# Altium schematic sheet downmixersA.SchDoc
size A4
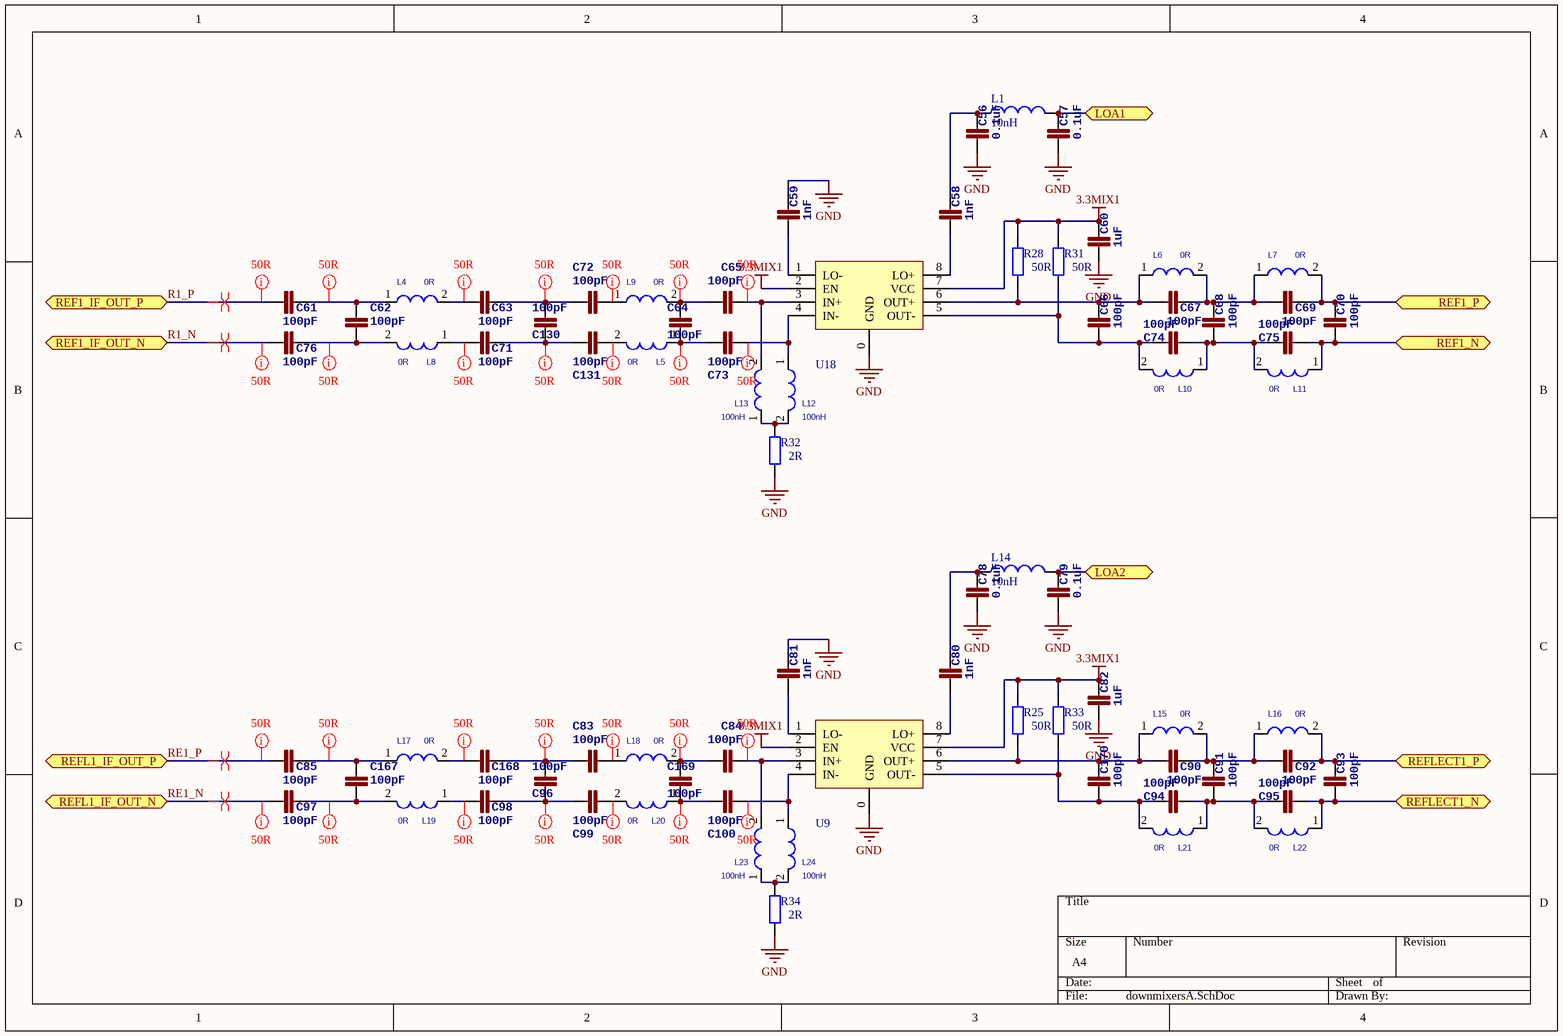
[diagram p0: downmixersA.SchDoc]

## Parts
C56  0.1uF  [0402]
C57  0.1uF  [0402]
C58  1nF  [0402]
C59  1nF  [0402]
C60  1uF  [0402]
C61  100pF  [0402]
C62  100pF  [0402]
C63  100pF  [0402]
C64  100pF  [0402]
C65  100pF  [0402]
C66  100pF  [0402]
C67  100pF  [0402]
C68  100pF  [0402]
C69  100pF  [0402]
C70  100pF  [0402]
C71  100pF  [0402]
C72  100pF  [0402]
C73  100pF  [0402]
C74  100pF  [0402]
C75  100pF  [0402]
C76  100pF  [0402]
C78  0.1uF  [0402]
C79  0.1uF  [0402]
C80  1nF  [0402]
C81  1nF  [0402]
C82  1uF  [0402]
C83  100pF  [0402]
C84  100pF  [0402]
C85  100pF  [0402]
C90  100pF  [0402]
C91  100pF  [0402]
C92  100pF  [0402]
C93  100pF  [0402]
C94  100pF  [0402]
C95  100pF  [0402]
C96  100pF  [0402]
C97  100pF  [0402]
C98  100pF  [0402]
C99  100pF  [0402]
C100  100pF  [0402]
C130  100pF  [0402]
C131  100pF  [0402]
C167  100pF  [0402]
C168  100pF  [0402]
C169  100pF  [0402]
C170  100pF  [0402]
L1  value 10nH  [0402]  (hidden comment: Inductor)
L4  0R  [0805]
L5  0R  [0805]
L6  0R  [0805]
L7  0R  [0805]
L8  0R  [0805]
L9  0R  [0805]
L10  0R  [0805]
L11  0R  [0805]
L12  100nH  [0402]
L13  100nH  [0402]
L14  value 10nH  [0402]  (hidden comment: Inductor)
L15  0R  [0805]
L16  0R  [0805]
L17  0R  [0805]
L18  0R  [0805]
L19  0R  [0805]
L20  0R  [0805]
L21  0R  [0805]
L22  0R  [0805]
L23  100nH  [0402]
L24  100nH  [0402]
R25  50R  [0402]
R28  50R  [0402]
R31  50R  [0402]
R32  2R  [0402]
R33  50R  [0402]
R34  2R  [0402]
U9  LT5560  [LT5560]  (value not drawn)
U18  LT5560  [LT5560]  (value not drawn)

## Ports
LOA1, LOA2, REF1_IF_OUT_N, REF1_IF_OUT_P, REF1_N, REF1_P, REFL1_IF_OUT_N, REFL1_IF_OUT_P, REFLECT1_N, REFLECT1_P

## Nets
3.3MIX1: C60.2 C82.2 R25.2 R28.2 R31.2 R33.2 U9.2(EN) U9.7(VCC) U18.2(EN) U18.7(VCC)
GND: C56.1 C57.1 C59.2 C60.1 C78.1 C79.1 C81.2 C82.1 R32.1 R34.1 U9.0(GND) U18.0(GND)
LOA1: C57.2 L1.2 ; port LOA1
LOA2: C79.2 L14.2 ; port LOA2
R1_N: C76.1 ; port REF1_IF_OUT_N
R1_P: C61.1 ; port REF1_IF_OUT_P
RE1_N: C97.1 ; port REFL1_IF_OUT_N
RE1_P: C85.1 ; port REFL1_IF_OUT_P
REF1_N: C70.1 C75.1 L11.1 ; port REF1_N
REF1_P: C69.2 C70.2 L7.2 ; port REF1_P
REFLECT1_N: C93.1 C95.1 L22.1 ; port REFLECT1_N
REFLECT1_P: C92.2 C93.2 L16.2 ; port REFLECT1_P
NetC56_2: C56.2 C58.2 L1.1
NetC58_1: C58.1 U18.8(LO+)
NetC59_1: C59.1 U18.1(LO-)
NetC61_2: C61.2 C62.2 L4.1
NetC62_1: C62.1 C76.2 L8.2
NetC63_1: C63.1 L4.2
NetC63_2: C63.2 C72.1 C130.1
NetC64_1: C64.1 C73.2 L5.1
NetC64_2: C64.2 C65.1 L9.2
NetC65_2: C65.2 L13.2 U18.3(IN+)
NetC66_1: C66.1 C74.2 L10.2 R31.1 U18.5(OUT-)
NetC66_2: C66.2 C67.1 L6.1 R28.1 U18.6(OUT+)
NetC67_2: C67.2 C68.2 C69.1 L6.2 L7.1
NetC68_1: C68.1 C74.1 C75.2 L10.1 L11.2
NetC71_1: C71.1 L8.1
NetC71_2: C71.2 C130.2 C131.2
NetC72_2: C72.2 L9.1
NetC73_1: C73.1 L12.1 U18.4(IN-)
NetC78_2: C78.2 C80.2 L14.1
NetC80_1: C80.1 U9.8(LO+)
NetC81_1: C81.1 U9.1(LO-)
NetC83_1: C83.1 C96.1 C168.2
NetC83_2: C83.2 L18.1
NetC84_1: C84.1 C169.2 L18.2
NetC84_2: C84.2 L23.2 U9.3(IN+)
NetC85_2: C85.2 C167.2 L17.1
NetC90_1: C90.1 C170.2 L15.1 R25.1 U9.6(OUT+)
NetC90_2: C90.2 C91.2 C92.1 L15.2 L16.1
NetC91_1: C91.1 C94.1 C95.2 L21.1 L22.2
NetC94_2: C94.2 C170.1 L21.2 R33.1 U9.5(OUT-)
NetC96_2: C96.2 C98.2 C99.2
NetC97_2: C97.2 C167.1 L19.2
NetC98_1: C98.1 L19.1
NetC99_1: C99.1 L20.2
NetC100_1: C100.1 L24.1 U9.4(IN-)
NetC100_2: C100.2 C169.1 L20.1
NetC131_1: C131.1 L5.2
NetC168_1: C168.1 L17.2
NetL12_2: L12.2 L13.1 R32.2
NetL23_1: L23.1 L24.2 R34.2

## Layout directives
net class 50R: NetC61_2, NetC62_1, NetC63_1, NetC63_2, NetC64_1, NetC64_2, NetC65_2, NetC71_1, NetC71_2, NetC72_2, NetC73_1, NetC83_1, NetC83_2, NetC84_1, NetC84_2, NetC85_2, NetC96_2, NetC97_2, NetC98_1, NetC99_1, NetC100_1, NetC100_2, NetC131_1, NetC168_1, R1_N, R1_P, RE1_N, RE1_P
differential pair: R1_N, R1_P, RE1_N, RE1_P

## Library data of the parts
C56-C76 C78-C85 C90-C100 C130 C131 C167-C170 = CAP0402-CAP: <b>Capacitor</b> / Standard 0603 ceramic capacitor, and 0.1" leaded capacitor.; PARTNO: CC0402ZRY5V7BB104
L1 L14 = Inductor: Code_IEC: 1005; Published: 8-Jun-2000; LatestRevisionDate: 29-May-2009; LatestRevisionNote: IPC-7351 Footprint Added.; PackageReference: 0402-A; Publisher: Altium Limited; PackageDescription: Chip Inductor; Code_JEITA: 0402
L4-L13 L15-L24 = L/2.5*2.0
R25 R28 R31-R34 = Res2: Resistor